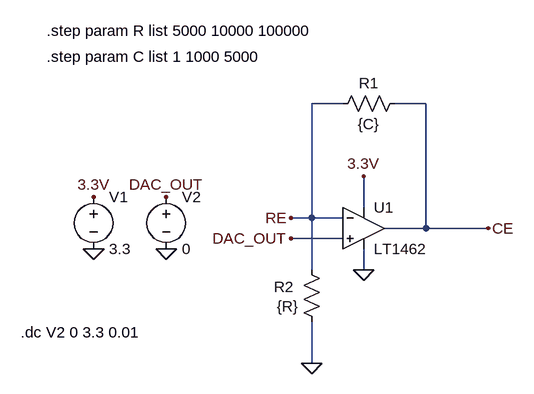
[diagram p0: schematic Control Amp LT1462.asc]
Control Amp LT1462.asc, the LTspice schematic file:
Version 4
SHEET 1 880 680
WIRE 144 -80 96 -80
WIRE 272 -80 224 -80
WIRE 176 80 176 32
WIRE 96 96 96 -80
WIRE 96 96 64 96
WIRE 144 96 96 96
WIRE 272 112 272 -80
WIRE 272 112 208 112
WIRE 368 112 272 112
WIRE 144 128 64 128
WIRE 96 176 96 96
WIRE 176 176 176 144
WIRE 96 320 96 256
FLAG -240 144 0
FLAG -240 64 3.3V
FLAG 64 96 RE
FLAG 176 176 0
FLAG 176 32 3.3V
FLAG 368 112 CE
FLAG 64 128 DAC_OUT
FLAG -128 64 DAC_OUT
FLAG -128 144 0
FLAG 96 320 0
SYMBOL OpAmps\\LT1462 176 48 R0
SYMATTR InstName U1
SYMBOL voltage -240 48 R0
WINDOW 123 0 0 Left 0
WINDOW 39 0 0 Left 0
SYMATTR InstName V1
SYMATTR Value 3.3
SYMBOL voltage -128 48 R0
WINDOW 123 0 0 Left 0
WINDOW 39 0 0 Left 0
SYMATTR InstName V2
SYMATTR Value 0
SYMBOL res 240 -96 R90
WINDOW 0 0 56 VBottom 2
WINDOW 3 32 56 VTop 2
SYMATTR InstName R1
SYMATTR Value {C}
SYMBOL res 112 272 R180
WINDOW 0 43 70 Left 2
WINDOW 3 36 40 Left 2
SYMATTR InstName R2
SYMATTR Value {R}
TEXT -352 272 Left 2 !.dc V2 0 3.3 0.01
TEXT -312 -192 Left 2 !.step param R list 5000 10000 100000
TEXT -312 -152 Left 2 !.step param C list 1 1000 5000

The netlist it stands for:
* Control Amp LT1462.asc
XU1 DAC_OUT RE 3.3V 0 CE LT1462  ; pins In+ In- V+ V- OUT
V1 3.3V 0 3.3
V2 DAC_OUT 0 0
R1 CE RE {C}
R2 0 RE {R}
.dc V2 0 3.3 0.01
.step param R list 5000 10000 100000
.step param C list 1 1000 5000
.lib LTC.lib
.backanno
.end